# EAGLE design dual-dac-w-32-ch-sh (EAGLE 7.2.0)
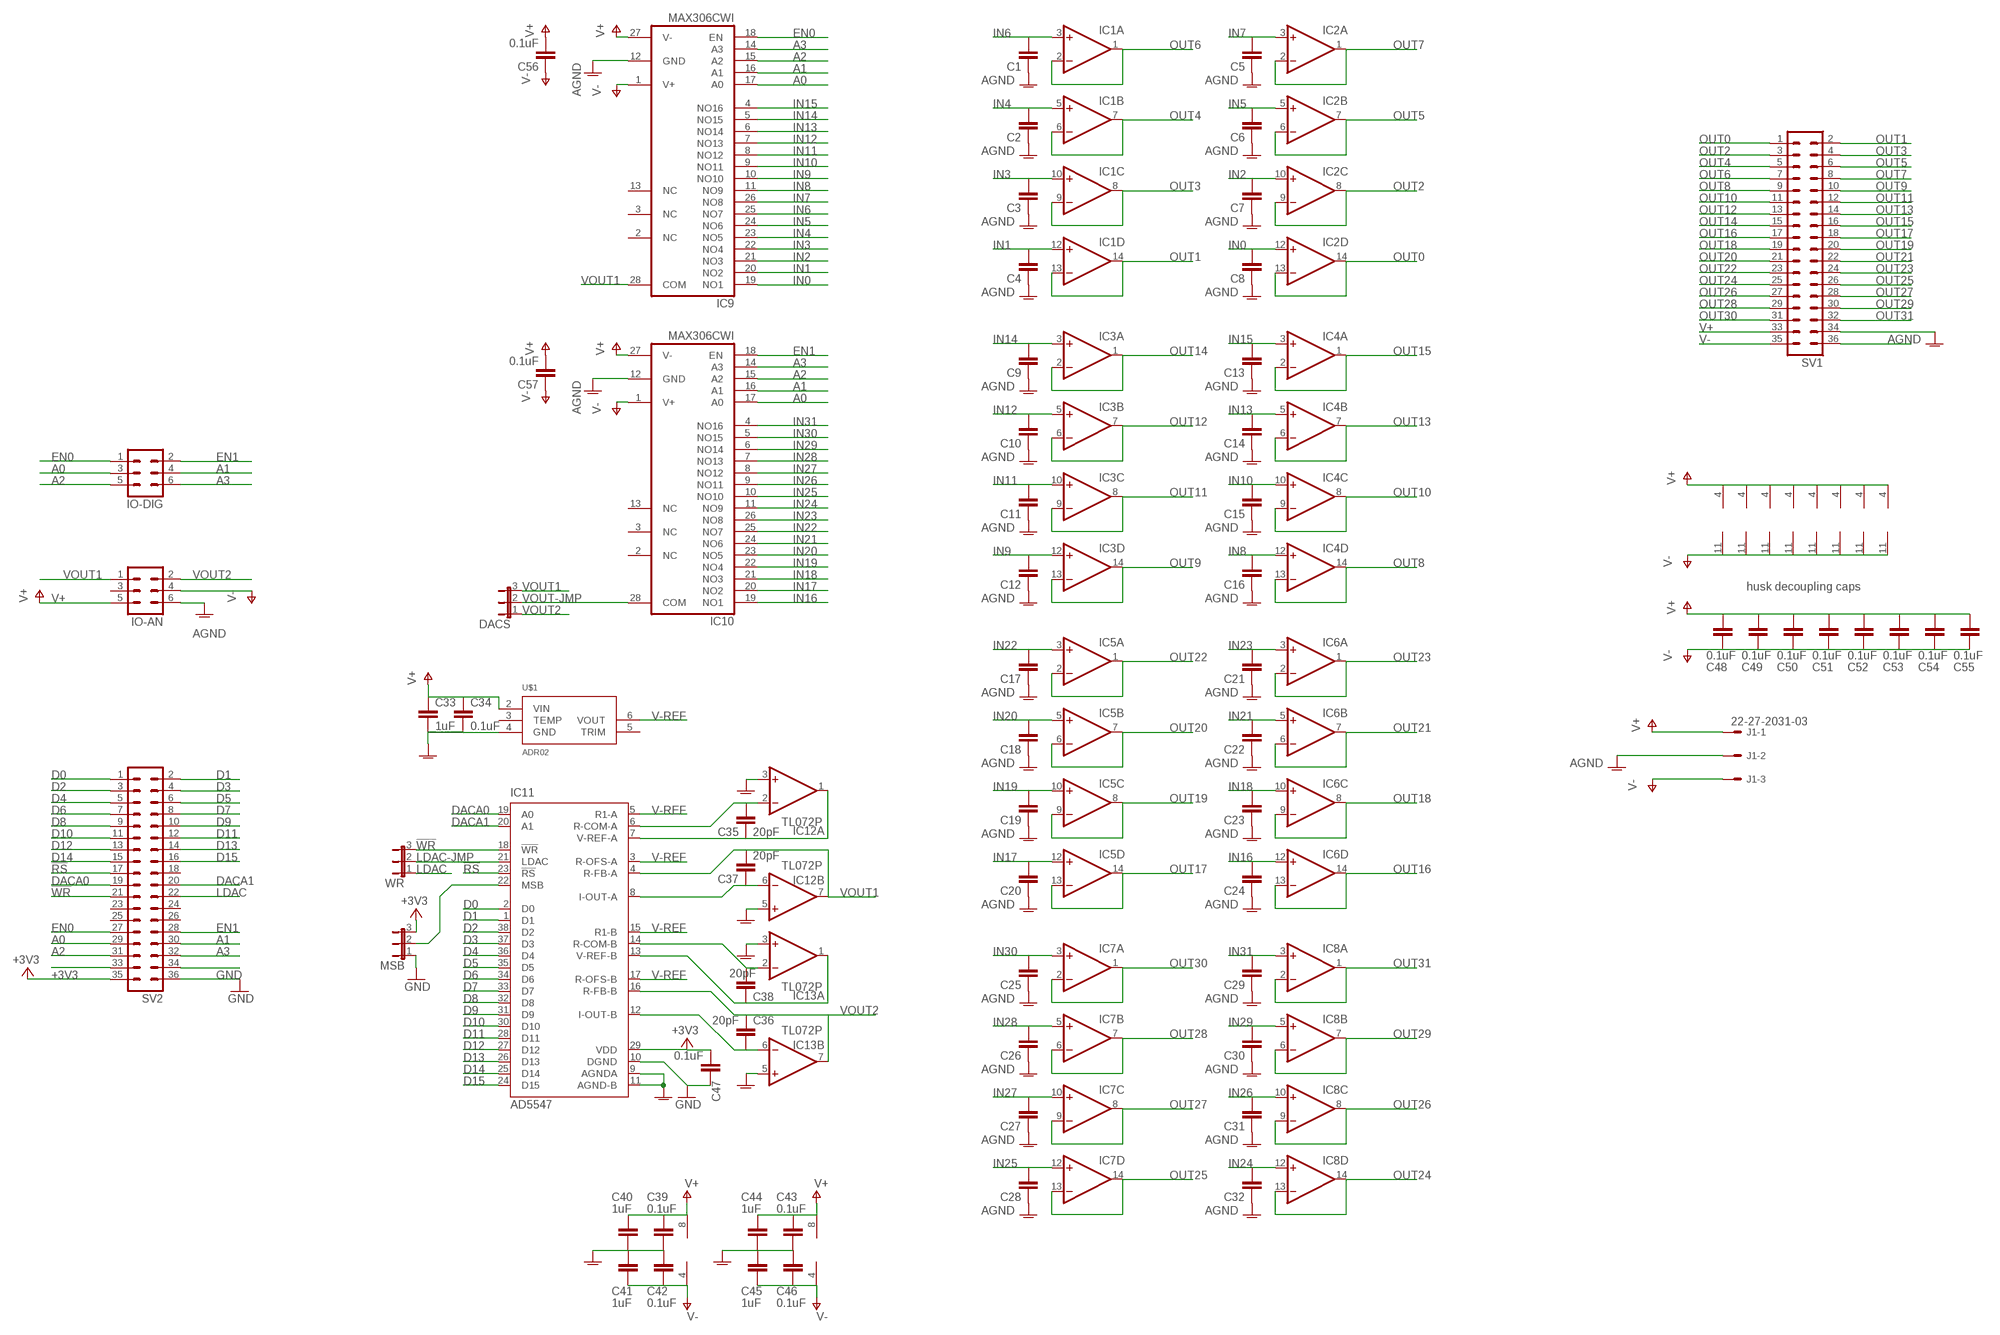
[diagram p0: schematic, sheet 1]

## Parts
C1  C-EUC1206  [C1206]
C2  C-EUC1206  [C1206]
C3  C-EUC1206  [C1206]
C4  C-EUC1206  [C1206]
C5  C-EUC1206  [C1206]
C6  C-EUC1206  [C1206]
C7  C-EUC1206  [C1206]
C8  C-EUC1206  [C1206]
C9  C-EUC1206  [C1206]
C10  C-EUC1206  [C1206]
C11  C-EUC1206  [C1206]
C12  C-EUC1206  [C1206]
C13  C-EUC1206  [C1206]
C14  C-EUC1206  [C1206]
C15  C-EUC1206  [C1206]
C16  C-EUC1206  [C1206]
C17  C-EUC1206  [C1206]
C18  C-EUC1206  [C1206]
C19  C-EUC1206  [C1206]
C20  C-EUC1206  [C1206]
C21  C-EUC1206  [C1206]
C22  C-EUC1206  [C1206]
C23  C-EUC1206  [C1206]
C24  C-EUC1206  [C1206]
C25  C-EUC1206  [C1206]
C26  C-EUC1206  [C1206]
C27  C-EUC1206  [C1206]
C28  C-EUC1206  [C1206]
C29  C-EUC1206  [C1206]
C30  C-EUC1206  [C1206]
C31  C-EUC1206  [C1206]
C32  C-EUC1206  [C1206]
C33  1uF  C-EUC0603  [C0603]
C34  0.1uF  C-EUC0603  [C0603]
C35  20pF  C-EUC0603  [C0603]
C36  20pF  C-EUC0603  [C0603]
C37  20pF  C-EUC0603  [C0603]
C38  20pF  C-EUC0603  [C0603]
C39  0.1uF  C-EUC0603  [C0603]
C40  1uF  C-EUC0603  [C0603]
C41  1uF  C-EUC0603  [C0603]
C42  0.1uF  C-EUC0603  [C0603]
C43  0.1uF  C-EUC0603  [C0603]
C44  1uF  C-EUC0603  [C0603]
C45  1uF  C-EUC0603  [C0603]
C46  0.1uF  C-EUC0603  [C0603]
C47  0.1uF  C-EUC0603  [C0603]
C48  0.1uF  C-EUC0603  [C0603]
C49  0.1uF  C-EUC0603  [C0603]
C50  0.1uF  C-EUC0603  [C0603]
C51  0.1uF  C-EUC0603  [C0603]
C52  0.1uF  C-EUC0603  [C0603]
C53  0.1uF  C-EUC0603  [C0603]
C54  0.1uF  C-EUC0603  [C0603]
C55  0.1uF  C-EUC0603  [C0603]
C56  0.1uF  C-EUC0603  [C0603]
C57  0.1uF  C-EUC0603  [C0603]
DACS  JP2E  [JP2]
IC1  TL074D  [SO14]
IC2  TL074D  [SO14]
IC3  TL074D  [SO14]
IC4  TL074D  [SO14]
IC5  TL074D  [SO14]
IC6  TL074D  [SO14]
IC7  TL074D  [SO14]
IC8  TL074D  [SO14]
IC9  MAX306CWI  [SO28L]
IC10  MAX306CWI  [SO28L]
IC11  AD5547  [TSSOP38]
IC12  TL072P  [DIL08]
IC13  TL072P  [DIL08]
IO-AN  MA03-2  [MA03-2]
IO-DIG  MA03-2  [MA03-2]
J1  22-27-2031-03  [6410-03]
MSB  JP2E  [JP2]
SV1  MA18-2  [MA18-2]
SV2  MA18-2  [MA18-2]
U$1  ADR02  [SO08]
WR  JP2E  [JP2]

## Nets
!RS: IC11.23(!RS) SV2.17
!WR: IC11.18(!WR) SV2.21 WR.3
+3V3: C47.1 IC11.29(VDD) MSB.3 SV2.35
A0: IC9.17(A0) IC10.17(A0) IO-DIG.3 SV2.29
A1: IC9.16(A1) IC10.16(A1) IO-DIG.4 SV2.30
A2: IC9.15(A2) IC10.15(A2) IO-DIG.5 SV2.31
A3: IC9.14(A3) IC10.14(A3) IO-DIG.6 SV2.32
AGND: C1.1 C2.1 C3.1 C4.1 C5.1 C6.1 C7.1 C8.1 C9.1 C10.1 C11.1 C12.1 C13.1 C14.1 C15.1 C16.1 C17.1 C18.1 C19.1 C20.1 C21.1 C22.1 C23.1 C24.1 C25.1 C26.1 C27.1 C28.1 C29.1 C30.1 C31.1 C32.1 C33.2 C34.2 C39.1 C40.1 C41.2 C42.2 C43.1 C44.1 C45.2 C46.2 IC9.12(GND) IC10.12(GND) IC11.9(AGNDA) IC11.11(AGND-B) IC12.3(A:+IN) IC12.5(B:+IN) IC13.3(A:+IN) IC13.5(B:+IN) IO-AN.6 J1.2 SV1.34 U$1.4(GND)
D0: IC11.2(D0) SV2.1
D1: IC11.1(D1) SV2.2
D2: IC11.38(D2) SV2.3
D3: IC11.37(D3) SV2.4
D4: IC11.36(D4) SV2.5
D5: IC11.35(D5) SV2.6
D6: IC11.34(D6) SV2.7
D7: IC11.33(D7) SV2.8
D8: IC11.32(D8) SV2.9
D9: IC11.31(D9) SV2.10
D10: IC11.30(D10) SV2.11
D11: IC11.28(D11) SV2.12
D12: IC11.27(D12) SV2.13
D13: IC11.26(D13) SV2.14
D14: IC11.25(D14) SV2.15
D15: IC11.24(D15) SV2.16
DACA0: IC11.19(A0) SV2.19
DACA1: IC11.20(A1) SV2.20
EN0: IC9.18(EN) IO-DIG.1 SV2.27
EN1: IC10.18(EN) IO-DIG.2 SV2.28
GND: C47.2 IC11.10(DGND) MSB.1 SV2.36
IN0: C8.2 IC2.12(D:+IN) IC9.19(NO1)
IN1: C4.2 IC1.12(D:+IN) IC9.20(NO2)
IN2: C7.2 IC2.10(C:+IN) IC9.21(NO3)
IN3: C3.2 IC1.10(C:+IN) IC9.22(NO4)
IN4: C2.2 IC1.5(B:+IN) IC9.23(NO5)
IN5: C6.2 IC2.5(B:+IN) IC9.24(NO6)
IN6: C1.2 IC1.3(A:+IN) IC9.25(NO7)
IN7: C5.2 IC2.3(A:+IN) IC9.26(NO8)
IN8: C16.2 IC4.12(D:+IN) IC9.11(NO9)
IN9: C12.2 IC3.12(D:+IN) IC9.10(NO10)
IN10: C15.2 IC4.10(C:+IN) IC9.9(NO11)
IN11: C11.2 IC3.10(C:+IN) IC9.8(NO12)
IN12: C10.2 IC3.5(B:+IN) IC9.7(NO13)
IN13: C14.2 IC4.5(B:+IN) IC9.6(NO14)
IN14: C9.2 IC3.3(A:+IN) IC9.5(NO15)
IN15: C13.2 IC4.3(A:+IN) IC9.4(NO16)
IN16: C24.2 IC6.12(D:+IN) IC10.19(NO1)
IN17: C20.2 IC5.12(D:+IN) IC10.20(NO2)
IN18: C23.2 IC6.10(C:+IN) IC10.21(NO3)
IN19: C19.2 IC5.10(C:+IN) IC10.22(NO4)
IN20: C18.2 IC5.5(B:+IN) IC10.23(NO5)
IN21: C22.2 IC6.5(B:+IN) IC10.24(NO6)
IN22: C17.2 IC5.3(A:+IN) IC10.25(NO7)
IN23: C21.2 IC6.3(A:+IN) IC10.26(NO8)
IN24: C32.2 IC8.12(D:+IN) IC10.11(NO9)
IN25: C28.2 IC7.12(D:+IN) IC10.10(NO10)
IN26: C31.2 IC8.10(C:+IN) IC10.9(NO11)
IN27: C27.2 IC7.10(C:+IN) IC10.8(NO12)
IN28: C26.2 IC7.5(B:+IN) IC10.7(NO13)
IN29: C30.2 IC8.5(B:+IN) IC10.6(NO14)
IN30: C25.2 IC7.3(A:+IN) IC10.5(NO15)
IN31: C29.2 IC8.3(A:+IN) IC10.4(NO16)
LDAC: SV2.22 WR.1
LDAC-JMP: IC11.21(LDAC) WR.2
N$1: C35.2 IC11.6(R-COM-A) IC12.2(A:-IN)
N$2: C35.1 IC11.7(V-REF-A) IC12.1(A:OUT)
N$3: C38.2 IC11.14(R-COM-B) IC13.2(A:-IN)
N$4: SV1.36
N$5: C38.1 IC11.13(V-REF-B) IC13.1(A:OUT)
N$6: IC11.22(MSB) MSB.2
N$7: C36.2 IC11.12(I-OUT-B) IC13.6(B:-IN)
N$10: C37.2 IC11.8(I-OUT-A) IC12.6(B:-IN)
N$12: SV2.33
N$16: SV2.34
OUT0: IC2.13(D:-IN) IC2.14(D:OUT) SV1.1
OUT1: IC1.13(D:-IN) IC1.14(D:OUT) SV1.2
OUT2: IC2.8(C:OUT) IC2.9(C:-IN) SV1.3
OUT3: IC1.8(C:OUT) IC1.9(C:-IN) SV1.4
OUT4: IC1.6(B:-IN) IC1.7(B:OUT) SV1.5
OUT5: IC2.6(B:-IN) IC2.7(B:OUT) SV1.6
OUT6: IC1.1(A:OUT) IC1.2(A:-IN) SV1.7
OUT7: IC2.1(A:OUT) IC2.2(A:-IN) SV1.8
OUT8: IC4.13(D:-IN) IC4.14(D:OUT) SV1.9
OUT9: IC3.13(D:-IN) IC3.14(D:OUT) SV1.10
OUT10: IC4.8(C:OUT) IC4.9(C:-IN) SV1.11
OUT11: IC3.8(C:OUT) IC3.9(C:-IN) SV1.12
OUT12: IC3.6(B:-IN) IC3.7(B:OUT) SV1.13
OUT13: IC4.6(B:-IN) IC4.7(B:OUT) SV1.14
OUT14: IC3.1(A:OUT) IC3.2(A:-IN) SV1.15
OUT15: IC4.1(A:OUT) IC4.2(A:-IN) SV1.16
OUT16: IC6.13(D:-IN) IC6.14(D:OUT) SV1.17
OUT17: IC5.13(D:-IN) IC5.14(D:OUT) SV1.18
OUT18: IC6.8(C:OUT) IC6.9(C:-IN) SV1.19
OUT19: IC5.8(C:OUT) IC5.9(C:-IN) SV1.20
OUT20: IC5.6(B:-IN) IC5.7(B:OUT) SV1.21
OUT21: IC6.6(B:-IN) IC6.7(B:OUT) SV1.22
OUT22: IC5.1(A:OUT) IC5.2(A:-IN) SV1.23
OUT23: IC6.1(A:OUT) IC6.2(A:-IN) SV1.24
OUT24: IC8.13(D:-IN) IC8.14(D:OUT) SV1.25
OUT25: IC7.13(D:-IN) IC7.14(D:OUT) SV1.26
OUT26: IC8.8(C:OUT) IC8.9(C:-IN) SV1.27
OUT27: IC7.8(C:OUT) IC7.9(C:-IN) SV1.28
OUT28: IC7.6(B:-IN) IC7.7(B:OUT) SV1.29
OUT29: IC8.6(B:-IN) IC8.7(B:OUT) SV1.30
OUT30: IC7.1(A:OUT) IC7.2(A:-IN) SV1.31
OUT31: IC8.1(A:OUT) IC8.2(A:-IN) SV1.32
V+: C33.1 C34.1 C39.2 C40.2 C43.2 C44.2 C48.2 C49.2 C50.2 C51.2 C52.2 C53.2 C54.2 C55.2 C56.2 C57.2 IC1.4(P:V+) IC2.4(P:V+) IC3.4(P:V+) IC4.4(P:V+) IC5.4(P:V+) IC6.4(P:V+) IC7.4(P:V+) IC8.4(P:V+) IC9.27(V-) IC10.27(V-) IC12.8(P:V+) IC13.8(P:V+) IO-AN.5 J1.1 SV1.33 U$1.2(VIN)
V-: C41.1 C42.1 C45.1 C46.1 C48.1 C49.1 C50.1 C51.1 C52.1 C53.1 C54.1 C55.1 C56.1 C57.1 IC1.11(P:V-) IC2.11(P:V-) IC3.11(P:V-) IC4.11(P:V-) IC5.11(P:V-) IC6.11(P:V-) IC7.11(P:V-) IC8.11(P:V-) IC9.1(V+) IC10.1(V+) IC12.4(P:V-) IC13.4(P:V-) IO-AN.4 J1.3 SV1.35
V-REF: IC11.3(R-OFS-A) IC11.5(R1-A) IC11.15(R1-B) IC11.17(R-OFS-B) U$1.6(VOUT)
VOUT1: C37.1 DACS.3 IC9.28(COM) IC11.4(R-FB-A) IC12.7(B:OUT) IO-AN.1
VOUT2: C36.1 DACS.1 IC11.16(R-FB-B) IC13.7(B:OUT) IO-AN.2
VOUT-JMP: DACS.2 IC10.28(COM)
Unconnected: IC9.2(NC) IC9.3(NC) IC9.13(NC) IC10.2(NC) IC10.3(NC) IC10.13(NC) IO-AN.3 SV2.18 SV2.23 SV2.24 SV2.25 SV2.26 U$1.3(TEMP) U$1.5(TRIM)

## Notes on the sheet
- husk decoupling caps

## Library data of the parts
C1-C57 = resistor:C-EU: CAPACITOR, European symbol
DACS MSB WR = jumper:JP2E: JUMPER
IC1-IC8 = linear:TL074: OP AMP
IC9 IC10 = maxim:MAX306CWI: MULTIPLEXER; MF: MAXIM; MPN: MAX306CWI; OC_FARNELL: unknown; OC_NEWARK: 90C2555
IC11 = joakim:AD5547: Dual-Current Output, Parallel Input 16 bit Multiplying DAC Source: http://www.analog.com/media/en/technical-documentation/data-sheets/AD5547_5557.pdf
IC12 IC13 = linear:TL072: OP AMP
IO-AN IO-DIG = con-lstb:MA03-2: PIN HEADER; OC_FARNELL: unknown; OC_NEWARK: unknown
J1 = con-molex:22-?-03: CONNECTOR wire to board 2.54 mm (.1 inch) pitch header; OC_FARNELL: unknown; OC_NEWARK: unknown
SV1 SV2 = con-lstb:MA18-2: PIN HEADER; OC_FARNELL: unknown; OC_NEWARK: unknown
U$1 = joakim:ADR02: Ultracompact Precision 5.0V Voltage Reference Analog Devices http://docs-europe.electrocomponents.com/webdocs/10ad/0900766b810adbed.pdf

## Board
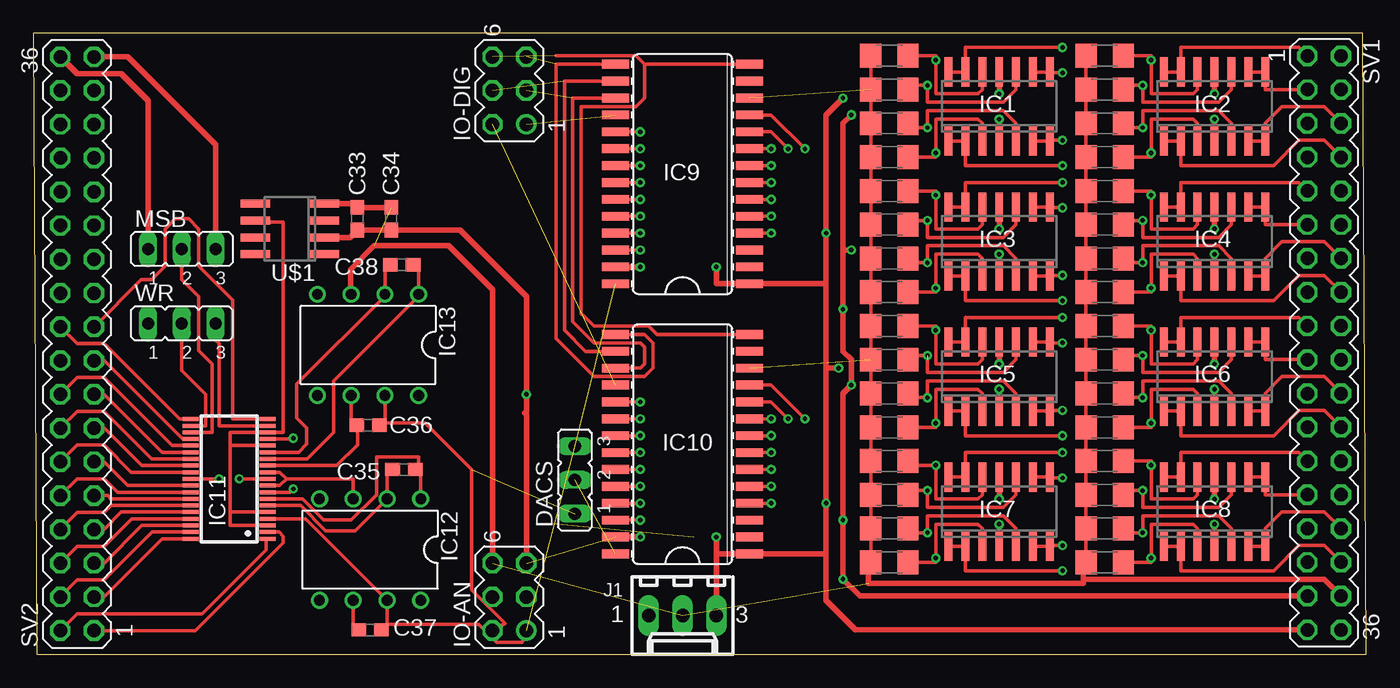
[diagram p1: board, top side]
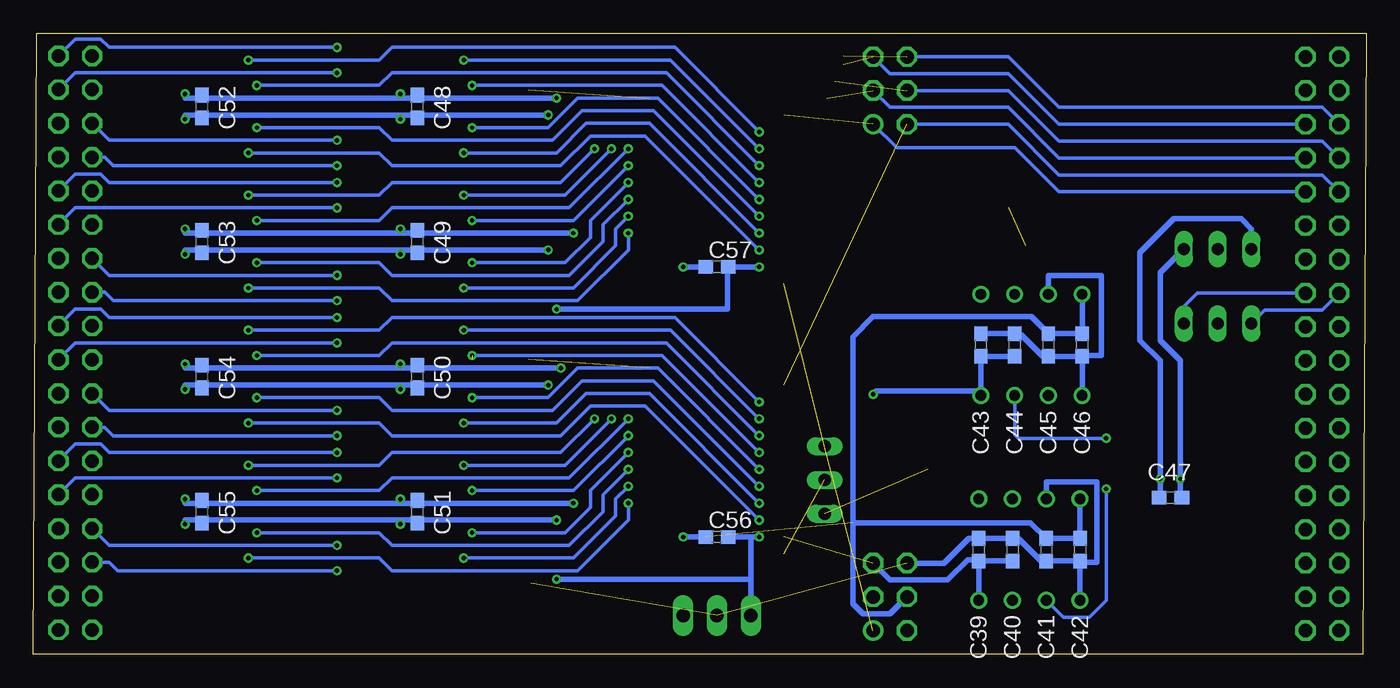
[diagram p2: board, bottom side, seen from below]

Size 100.25 x 46.73 mm. Coordinates in mm from the lower left corner, seen from the top.
Outline: 0.25,0 100.25,0 100,46.73 0,46.73 0.25,0
Copper layers (1*16): Top 0.0356mm / dielectric 1.5011mm / Bottom 0.0356mm
Design rules "LaenPCBOrder": minimum track width 6mil, minimum drill 13mil, track to track 6mil, track to pad 6mil, pad to pad 6mil, via to via 6mil, smd to smd 6mil, copper to edge 15mil, drill to drill 6mil, minimum pad ring 7mil, minimum via ring 7mil, stop-mask expansion 3mil, vias tented up to drill 0mil, thermal gap 10mil

### Footprints (pad centres in the part's own frame; a part is rotated, then mirrored left to right if it is on the bottom)
C1206 = smd 1.6 x 1.8: 1 -1.4,0; 2 1.4,0
C0603 = smd 1.1 x 1: 1 -0.85,0; 2 0.85,0
JP2 = drill 0.914 long: 1 -2.54,0; 2 0,0; 3 2.54,0
SO14 = smd 0.6 x 2.2: 1 -3.81,-2.6; 2 -2.54,-2.6; 3 -1.27,-2.6; 4 0,-2.6; 5 1.27,-2.6; 6 2.54,-2.6; 7 3.81,-2.6; 8 3.81,2.6; 9 2.54,2.6; 10 1.27,2.6; 11 0,2.6; 12 -1.27,2.6; 13 -2.54,2.6; 14 -3.81,2.6
SO28L = smd 0.66 x 2.032: 1 -8.255,-5.029; 2 -6.985,-5.029; 3 -5.715,-5.029; 4 -4.445,-5.029; 5 -3.175,-5.029; 6 -1.905,-5.029; 7 -0.635,-5.029; 8 0.635,-5.029; 9 1.905,-5.029; 10 3.175,-5.029; 11 4.445,-5.029; 12 5.715,-5.029; 13 6.985,-5.029; 14 8.255,-5.029; 15 8.255,5.029; 16 6.985,5.029; 17 5.715,5.029; 18 4.445,5.029; 19 3.175,5.029; 20 1.905,5.029; 21 0.635,5.029; 22 -0.635,5.029; 23 -1.905,5.029; 24 -3.175,5.029; 25 -4.445,5.029; 26 -5.715,5.029; 27 -6.985,5.029; 28 -8.255,5.029
TSSOP38 = smd 0.3 x 1.2: 1 -4.5,-2.9; 2 -4,-2.9; 3 -3.5,-2.9; 4 -3,-2.9; 5 -2.5,-2.9; 6 -2,-2.9; 7 -1.5,-2.9; 8 -1,-2.9; 9 -0.5,-2.9; 10 0,-2.9; 11 0.5,-2.9; 12 1,-2.9; 13 1.5,-2.9; 14 2,-2.9; 15 2.5,-2.9; 16 3,-2.9; 17 3.5,-2.9; 18 4,-2.9; 19 4.5,-2.9; 20 4.5,2.9; 21 4,2.9; 22 3.5,2.9; 23 3,2.9; 24 2.5,2.9; 25 2,2.9; 26 1.5,2.9; 27 1,2.9; 28 0.5,2.9; 29 0,2.9; 30 -0.5,2.9; 31 -1,2.9; 32 -1.5,2.9; 33 -2,2.9; 34 -2.5,2.9; 35 -3,2.9; 36 -3.5,2.9; 37 -4,2.9; 38 -4.5,2.9
DIL08 = drill 0.813 pad 1.27: 1 -3.81,-3.81; 2 -1.27,-3.81; 3 1.27,-3.81; 4 3.81,-3.81; 5 3.81,3.81; 6 1.27,3.81; 7 -1.27,3.81; 8 -3.81,3.81
MA03-2 = drill 1.016: 1 -2.54,-1.27 | drill 1.016 octagon: 2 -2.54,1.27; 3 0,-1.27; 4 0,1.27; 5 2.54,-1.27; 6 2.54,1.27
6410-03 = drill 1.016 long: 1 2.54,0; 2 0,0; 3 -2.54,0
MA18-2 = drill 1.016 octagon: 1 -21.59,-1.27; 2 -21.59,1.27; 3 -19.05,-1.27; 4 -19.05,1.27; 5 -16.51,-1.27; 6 -16.51,1.27; 7 -13.97,-1.27; 8 -13.97,1.27; 9 -11.43,-1.27; 10 -11.43,1.27; 11 -8.89,-1.27; 12 -8.89,1.27; 13 -6.35,-1.27; 14 -6.35,1.27; 15 -3.81,-1.27; 16 -3.81,1.27; 17 -1.27,-1.27; 18 -1.27,1.27; 19 1.27,-1.27; 20 1.27,1.27; 21 3.81,-1.27; 22 3.81,1.27; 23 6.35,-1.27; 24 6.35,1.27; 25 8.89,-1.27; 26 8.89,1.27; 27 11.43,-1.27; 28 11.43,1.27; 29 13.97,-1.27; 30 13.97,1.27; 31 16.51,-1.27; 32 16.51,1.27; 33 19.05,-1.27; 34 19.05,1.27; 35 21.59,-1.27; 36 21.59,1.27
SO08 = smd 0.6 x 2.2: 1 -1.905,-2.6; 2 -0.635,-2.6; 3 0.635,-2.6; 4 1.905,-2.6; 5 1.905,2.6; 6 0.635,2.6; 7 -0.635,2.6; 8 -1.905,2.6

### Placement (x,y rotation side)
C1  64.39,37.4 0 top
C2  64.39,39.94 0 top
C3  64.39,42.48 0 top
C4  64.39,45.02 0 top
C5  80.58,37.4 0 top
C6  80.58,39.94 0 top
C7  80.58,42.48 0 top
C8  80.58,45.02 0 top
C9  64.39,27.24 0 top
C10  64.39,29.78 0 top
C11  64.39,32.32 0 top
C12  64.39,34.86 0 top
C13  80.58,27.24 0 top
C14  80.58,29.78 0 top
C15  80.58,32.32 0 top
C16  80.58,34.86 0 top
C17  64.39,17.08 0 top
C18  64.39,19.62 0 top
C19  64.39,22.16 0 top
C20  64.39,24.7 0 top
C21  80.58,17.08 0 top
C22  80.58,19.62 0 top
C23  80.58,22.16 0 top
C24  80.58,24.7 0 top
C25  64.39,6.92 0 top
C26  64.39,9.46 0 top
C27  64.39,12 0 top
C28  64.39,14.54 0 top
C29  80.58,6.92 0 top
C30  80.58,9.46 0 top
C31  80.58,12 0 top
C32  80.58,14.54 0 top
C33  24.38,32.77 90 top
C34  26.92,32.77 90 top
C35  27.88,13.91 180 top
C36  25.18,17.24 180 top
C37  25.34,1.84 180 top
C38  27.72,29.31 180 top
C39  29.15,7.87 270 bottom
C40  26.61,7.87 270 bottom
C41  24.07,7.87 270 bottom
C42  21.53,7.87 270 bottom
C43  28.99,23.27 270 bottom
C44  26.45,23.27 270 bottom
C45  23.91,23.27 270 bottom
C46  21.37,23.27 270 bottom
C47  14.72,11.79 180 bottom
C48  71.37,41.21 270 bottom
C49  71.37,31.05 270 bottom
C50  71.37,20.89 270 bottom
C51  71.37,10.73 270 bottom
C52  87.57,41.21 270 bottom
C53  87.57,31.05 270 bottom
C54  87.57,20.89 270 bottom
C55  87.57,10.73 270 bottom
C56  48.83,8.83 0 bottom
C57  48.83,29.15 0 bottom
DACS  40.74,13.11 90 top
IC1  72.64,41.21 0 top
IC2  88.84,41.21 0 top
IC3  72.64,31.05 0 top
IC4  88.84,31.05 0 top
IC5  72.64,20.89 0 top
IC6  88.84,20.89 0 top
IC7  72.64,10.73 0 top
IC8  88.84,10.73 0 top
IC9  48.83,36.13 90 top
IC10  48.83,15.81 90 top
IC11  14.74,13.2 90 top
IC12  25.34,7.87 180 top
IC13  25.18,23.27 180 top
IO-AN  35.81,4.32 90 top
IO-DIG  35.81,42.42 90 top
J1  48.83,2.92 180 top
MSB  11.18,30.48 0 top
SV1  97.09,23.43 270 top
SV2  3.3,23.37 90 top
U$1  19.3,32 90 top
WR  11.18,24.89 0 top

### Tracks (layer width: path | path; a pad name or v marks a point on that pad's centre or on a via)
!RS
  Top 0.254: SV2.17 5.33,22.1 11.23,16.2 IC11.23
!WR
  Top 0.254: IC11.18 13.97,17.2 13.97,23.37 13.72,23.62 WR.3
  Bottom 0.254: SV2.21 12.7,27.18 13.72,26.16 WR.3
+3V3  (via drill 0.33)
  Top 0.254: IC11.29 v13.97,13.2
  Top 0.406: SV2.35 7.11,44.96 13.72,38.35 MSB.3
  Bottom 0.406: MSB.3 15.49,28.7 15.49,23.62 13.97,22.1 v13.97,13.2 13.97,11.68 13.87,11.78 C47.1
A0  (1 unrouted)
  Top 0.254: IC9.17 40.58,41.85 40.58,25.02 42.16,23.43 45.66,23.43 45.97,23.11 45.97,21.84 45.66,21.53 IC10.17
  Bottom 0.254: SV2.29 23.11,37.34 26.92,41.15 35.81,41.15 IO-DIG.3
A1  (1 unrouted)
  Top 0.254: IC9.16 39.94,43.12 39.94,24.38 41.53,22.8 IC10.16
  Bottom 0.254: SV2.30 3.3,38.61 23.11,38.61 26.92,42.42 IO-DIG.4
A2  (1 unrouted)
  Top 0.254: 40.89,44.39 IC9.15 39.31,44.39 39.31,23.75 42.16,20.89 45.97,20.89 46.61,21.53 46.61,23.43 45.97,24.07 IC10.15
  Bottom 0.254: SV2.31 23.11,39.88 26.92,43.69 35.81,43.69 IO-DIG.5
A3  (1 unrouted)
  Top 0.254: IC9.14 45.97,44.39 | 39.31,45.02 45.34,45.02 45.97,44.39 | IC10.14 46.93,24.07 46.29,24.7 42.16,24.7 41.43,25.43 41.21,25.65 41.21,41.21 45.34,41.21 45.97,41.85 45.97,44.39
  Bottom 0.254: SV2.32 3.3,41.15 23.11,41.15 26.92,44.96 IO-DIG.6
AGND  (via drill 0.33)  (5 unrouted)
  Top 0.254: C8.1 C7.1 C6.1 C5.1 C15.1 C16.1 C13.1 C14.1 C22.1 C23.1 C24.1 C21.1 C30.1 C31.1 C29.1 C32.1 | C4.1 C3.1 C2.1 C1.1 C12.1 C11.1 C10.1 C9.1 C19.1 C20.1 C17.1 C18.1 C27.1 C28.1 C25.1 C26.1 | 17.64,12.72 IC11.9 18.54,12.7 19.05,13.21 | 19.05,13.21 18.54,13.7 IC11.11 | 19.05,13.21 24.07,13.21 IC12.3
  Top 0.406: SV1.34 97.09,5.65 78.99,5.65 | 78.99,5.65 78.99,5.33 62.8,5.33 62.8,6.73 C25.1 | 78.99,5.65 78.99,6.73 C29.1 | U$1.4 24.09,33.91 C33.2 C34.2 | v23.88,27.18 23.88,28.96 25.65,30.73 31.24,30.73 34.54,27.43 IO-AN.6
  Bottom 0.406: IC12.5 C42.2 | C42.2 C41.2 24.49,7.02 26.13,8.67 26.55,8.67 C40.1 C39.1 29.88,8.72 31.75,6.86 IO-AN.6 | IC13.5 C46.2 | C46.2 C45.2 24.33,22.42 25.97,24.07 26.39,24.07 C44.1 C43.1 | IC12.3 24.07,12.95 20.26,12.95 20.26,6.92 21.42,6.92 C42.2 | IC13.3 23.91,27.21 | C46.2 21.31,22.48 19.94,22.48 19.94,28.51 23.91,28.51 23.91,27.21 | 23.91,27.21 v23.88,27.18
D0
  Top 0.254: SV2.1 12.19,1.78 18.8,8.38 18.8,8.89 18.49,9.2 IC11.2
D1
  Top 0.254: SV2.2 3.3,3.05 12.7,3.05 17.53,7.87 17.53,8.58 IC11.1
D2
  Top 0.254: IC11.38 9.71,8.7 5.33,4.32 SV2.3
D3
  Top 0.254: IC11.37 8.94,9.2 5.33,5.59 3.3,5.59 SV2.4
D4
  Top 0.254: IC11.36 8.17,9.7 5.33,6.86 SV2.5
D5
  Top 0.254: IC11.35 7.4,10.2 5.33,8.13 3.3,8.13 SV2.6
D6
  Top 0.254: IC11.34 6.63,10.7 5.33,9.4 SV2.7
D7
  Top 0.254: IC11.33 5.86,11.2 5.33,10.67 3.3,10.67 SV2.8
D8
  Top 0.254: IC11.32 5.83,11.7 5.59,11.94 SV2.9
D9
  Top 0.254: IC11.31 6.35,12.2 5.33,13.21 3.3,13.21 SV2.10
D10
  Top 0.254: IC11.30 7.12,12.7 5.33,14.48 SV2.11
D11
  Top 0.254: IC11.28 7.38,13.7 5.33,15.75 3.3,15.75 SV2.12
D12
  Top 0.254: IC11.27 8.15,14.2 5.33,17.02 SV2.13
D13
  Top 0.254: IC11.26 8.92,14.7 5.33,18.29 3.3,18.29 SV2.14
D14
  Top 0.254: IC11.25 9.7,15.2 5.33,19.56 SV2.15
D15
  Top 0.254: IC11.24 10.46,15.7 5.33,20.83 3.3,20.83 SV2.16
DACA0
  Top 0.254: SV2.19 8.13,28.19 8.89,28.19 9.91,29.21 9.91,32 10.67,32.77 11.68,32.77 12.45,32 12.45,29.21 14.99,26.67 14.99,17.7 IC11.19
DACA1
  Top 0.254: SV2.20 3.3,23.37 5.33,23.37 11,17.7 IC11.20
EN0  (1 unrouted)
  Bottom 0.254: SV2.27 23.11,34.8 26.42,38.1 35.31,38.1 IO-DIG.1
EN1  (1 unrouted)
  Bottom 0.254: SV2.28 3.3,36.07 23.11,36.07 26.92,39.88 IO-DIG.2
GND  (via drill 0.33)
  Top 0.254: IC11.10 15.53,13.2 | 15.49,13.16 15.53,13.2 | 15.53,13.2 v15.5,13.2 v15.49,13.21
  Top 0.406: SV2.36 3.3,43.69 6.6,43.69 8.64,41.66 MSB.1
  Bottom 0.406: MSB.1 8.64,32 9.4,32.77 14.48,32.77 17.02,30.23 17.02,23.62 15.49,22.1 v15.49,13.21 15.49,11.68 15.57,11.76 C47.2
IN0  (via drill 0.33)
  Top 0.254: IC2.12 87.57,42.48 87.25,42.16 84.07,42.16 v84.07,44.7 84.07,45.02 C8.2 | IC9.19 v45.66,39.31
  Bottom 0.254: v84.07,44.7 74.23,44.7 73.28,45.66 52.01,45.66 v45.66,39.31
IN1  (via drill 0.33)
  Top 0.254: IC1.12 71.37,42.48 71.06,42.16 67.88,42.16 v67.88,44.7 67.88,45.02 C4.2 | v45.66,38.04 IC9.20
  Bottom 0.254: v67.88,44.7 52.32,44.7 v45.66,38.04
IN2  (via drill 0.33)
  Top 0.254: C7.2 82.62,42.35 82.49,42.48 82.8,42.8 v83.44,42.8 83.44,41.53 89.15,41.53 90.11,42.48 IC2.10 | v45.66,36.77 IC9.21
  Bottom 0.254: v83.44,42.8 74.23,42.8 73.28,43.75 52.64,43.75 v45.66,36.77
IN3  (via drill 0.33)
  Top 0.254: IC1.10 73.91,42.48 72.96,41.53 67.25,41.53 v67.25,42.8 66.11,42.8 C3.2 | v45.66,35.5 IC9.22
  Bottom 0.254: v67.25,42.8 52.96,42.8 v45.66,35.5
IN4  (via drill 0.33)
  Top 0.254: 66.42,40.07 C2.2 66.11,39.62 v67.25,39.62 67.25,40.89 72.96,40.89 73.91,39.94 IC1.5 | v45.66,34.23 IC9.23
  Bottom 0.254: v67.25,39.62 61.53,39.62 59.31,41.85 53.28,41.85 v45.66,34.23
IN5  (via drill 0.33)
  Top 0.254: 82.62,40.07 C6.2 82.3,39.62 v83.44,39.62 83.44,40.89 89.15,40.89 90.11,39.94 IC2.5 | v45.66,32.96 IC9.24
  Bottom 0.254: v83.44,39.62 74.23,39.62 73.28,38.67 61.21,38.67 58.99,40.89 53.59,40.89 v45.66,32.96
IN6  (via drill 0.33)
  Top 0.254: IC1.3 71.37,39.94 71.06,40.26 67.88,40.26 v67.88,37.72 67.88,37.4 C1.2 | v45.66,31.69 IC9.25
  Bottom 0.254: v67.88,37.72 60.9,37.72 58.67,39.94 53.91,39.94 v45.66,31.69
IN7  (via drill 0.33)
  Top 0.254: IC2.3 87.57,39.94 87.25,40.26 84.07,40.26 v84.07,37.72 84.07,37.4 C5.2 | v45.66,30.42 IC9.26
  Bottom 0.254: v84.07,37.72 74.23,37.72 73.28,36.77 60.58,36.77 58.36,38.99 54.23,38.99 v45.66,30.42
IN8  (via drill 0.33)
  Top 0.254: IC4.12 87.57,32.32 87.25,32 84.07,32 v84.07,34.54 84.07,34.86 C16.2 | v58.04,38.04 55.5,40.58 IC9.11
  Bottom 0.254: v84.07,34.54 74.23,34.54 73.28,35.5 60.58,35.5 v58.04,38.04
IN9  (via drill 0.33)
  Top 0.254: IC3.12 71.37,32.32 71.06,32 67.88,32 v67.88,34.54 67.88,34.86 C12.2 | v56.77,38.04 55.5,39.31 IC9.10
  Bottom 0.254: v67.88,34.54 60.26,34.54 v56.77,38.04
IN10  (via drill 0.33)
  Top 0.254: IC4.10 90.11,32.32 89.15,31.37 83.44,31.37 v83.44,32.64 82.8,32.64 82.49,32.32 C15.2 | v55.5,38.04 IC9.9
  Bottom 0.254: v83.44,32.64 74.23,32.64 73.28,33.59 59.94,33.59 v55.5,38.04
IN11  (via drill 0.33)
  Top 0.254: IC3.10 73.91,32.32 72.96,31.37 67.25,31.37 v67.25,32.64 66.61,32.64 C11.2 | v55.5,36.77 IC9.8
  Bottom 0.254: v67.25,32.64 59.63,32.64 v55.5,36.77
IN12  (via drill 0.33)
  Top 0.254: IC3.5 73.91,29.78 72.96,30.73 67.25,30.73 v67.25,29.46 66.61,29.46 66.29,29.78 C10.2 | v55.5,35.5 IC9.7
  Bottom 0.254: v67.25,29.46 60.26,29.46 58.36,31.37 58.36,32.64 v55.5,35.5
IN13  (via drill 0.33)
  Top 0.254: IC4.5 90.11,29.78 89.15,30.73 83.44,30.73 v83.44,29.46 82.8,29.46 82.49,29.78 C14.2 | v55.5,34.23 IC9.6
  Bottom 0.254: v83.44,29.46 74.23,29.46 73.28,28.51 59.94,28.51 57.4,31.05 57.4,32.32 v55.5,34.23
IN14  (via drill 0.33)
  Top 0.254: IC3.3 71.37,29.78 71.06,30.1 67.88,30.1 v67.88,27.56 67.88,27.24 C9.2 | v55.5,32.96 IC9.5
  Bottom 0.254: v67.88,27.56 59.63,27.56 56.45,30.73 56.45,32 v55.5,32.96
IN15  (via drill 0.33)
  Top 0.254: IC4.3 87.57,29.78 87.25,30.1 84.07,30.1 v84.07,27.56 84.07,27.24 C13.2 | IC9.4 v55.5,31.69
  Bottom 0.254: v84.07,27.56 74.23,27.56 73.28,26.61 59.31,26.61 55.5,30.42 v55.5,31.69
IN16  (via drill 0.33)
  Top 0.254: IC6.12 87.57,22.16 87.25,21.84 84.07,21.84 v84.07,24.38 84.07,24.7 C24.2 | IC10.19 v45.66,18.99
  Bottom 0.254: v45.66,18.99 52.01,25.34 73.28,25.34 74.23,24.38 v84.07,24.38
IN17  (via drill 0.33)
  Top 0.254: IC5.12 71.37,22.16 71.06,21.84 67.88,21.84 v67.88,24.38 67.88,24.7 C20.2 | IC10.20 v45.66,17.72
  Bottom 0.254: v45.66,17.72 52.32,24.38 v67.88,24.38
IN18  (via drill 0.33)
  Top 0.254: IC6.10 90.11,22.16 89.15,21.21 83.44,21.21 v83.44,22.48 82.49,22.48 82.17,22.16 C23.2 | IC10.21 v45.66,16.45
  Bottom 0.254: v45.66,16.45 52.64,23.43 73.28,23.43 74.23,22.48 v83.44,22.48
IN19  (via drill 0.33)  (1 unrouted)
  Top 0.254: IC5.10 73.91,22.16 72.96,21.21 67.25,21.21 67.25,22.16 | IC10.22 v45.66,15.18 | v67.25,22.48 66.29,22.48 65.98,22.16 C19.2
  Bottom 0.254: v45.66,15.18 52.96,22.48 v67.25,22.48
IN20  (via drill 0.33)
  Top 0.254: IC10.23 v45.66,13.91 | C18.2 66.11,19.3 v67.25,19.3 67.25,20.57 72.96,20.57 73.91,19.62 IC5.5
  Bottom 0.254: v45.66,13.91 53.28,21.53 59.31,21.53 61.53,19.3 v67.25,19.3
IN21  (via drill 0.33)
  Top 0.254: IC10.24 v45.66,12.64 | v83.44,19.3 82.3,19.3 C22.2 81.98,19.49 82.17,19.3 v83.44,19.3 | v83.44,19.3 83.44,20.57 89.15,20.57 90.11,19.62 IC6.5
  Bottom 0.254: v45.66,12.64 53.59,20.57 58.99,20.57 61.21,18.35 73.28,18.35 74.23,19.3 v83.44,19.3
IN22  (via drill 0.33)
  Top 0.254: IC5.3 71.37,19.62 71.06,19.94 67.88,19.94 v67.88,17.4 67.88,17.08 C17.2 | IC10.25 v45.66,11.37
  Bottom 0.254: v45.66,11.37 53.91,19.62 58.67,19.62 60.9,17.4 v67.88,17.4
IN23  (via drill 0.33)
  Top 0.254: IC6.3 87.57,19.62 87.25,19.94 84.07,19.94 v84.07,17.4 84.07,17.08 C21.2 | IC10.26 v45.66,10.1
  Bottom 0.254: v45.66,10.1 54.23,18.67 58.36,18.67 60.58,16.45 73.28,16.45 74.23,17.4 v84.07,17.4
IN24  (via drill 0.33)
  Top 0.254: IC8.12 87.57,12 87.25,11.68 84.07,11.68 v84.07,14.22 84.07,14.54 C32.2 | IC10.11 55.5,20.26 v58.04,17.72
  Bottom 0.254: v58.04,17.72 60.58,15.18 73.28,15.18 74.23,14.22 v84.07,14.22
IN25  (via drill 0.33)
  Top 0.254: IC7.12 71.37,12 71.06,11.68 67.88,11.68 v67.88,14.22 66.29,14.22 | IC10.10 55.5,18.99 v56.77,17.72 | 66.29,14.22 66.11,14.22 C28.2 65.98,14.54 66.29,14.22
  Bottom 0.254: v56.77,17.72 60.26,14.22 v67.88,14.22
IN26  (via drill 0.33)
  Top 0.254: IC8.10 90.11,12 89.15,11.05 83.44,11.05 v83.44,12.32 82.49,12.32 82.17,12 C31.2 | IC10.9 v55.5,17.72
  Bottom 0.254: v55.5,17.72 59.94,13.27 73.28,13.27 74.23,12.32 v83.44,12.32
IN27  (via drill 0.33)
  Top 0.254: IC7.10 73.91,12 72.96,11.05 67.25,11.05 v67.25,12.32 66.29,12.32 | IC10.8 v55.5,16.45 | 66.29,12.32 66.11,12.32 C27.2 65.98,12 66.29,12.32
  Bottom 0.254: v55.5,16.45 59.63,12.32 v67.25,12.32
IN28  (via drill 0.33)
  Top 0.254: IC7.5 73.91,9.46 72.96,10.41 67.25,10.41 v67.25,9.14 66.29,9.14 | IC10.7 v55.5,15.18 | 66.29,9.14 66.11,9.14 C26.2 65.98,9.46 66.29,9.14
  Bottom 0.254: v55.5,15.18 58.36,12.32 58.36,11.05 60.26,9.14 v67.25,9.14
IN29  (via drill 0.33)
  Top 0.254: IC8.5 90.11,9.46 89.15,10.41 83.44,10.41 v83.44,9.14 82.49,9.14 | IC10.6 v55.5,13.91 | 82.49,9.14 82.3,9.14 C30.2 82.17,9.46 82.49,9.14
  Bottom 0.254: v55.5,13.91 57.4,12 57.4,10.73 59.94,8.19 73.28,8.19 74.23,9.14 v83.44,9.14
IN30  (via drill 0.33)
  Top 0.254: IC7.3 71.37,9.46 71.06,9.78 67.88,9.78 v67.88,7.24 67.88,6.92 C25.2 | IC10.5 v55.5,12.64
  Bottom 0.254: v55.5,12.64 56.45,11.68 56.45,10.41 59.63,7.24 v67.88,7.24
IN31  (via drill 0.33)
  Top 0.254: IC8.3 87.57,9.46 87.25,9.78 84.07,9.78 v84.07,7.24 84.07,6.92 C29.2 | IC10.4 v55.5,11.37
  Bottom 0.254: v55.5,11.37 55.5,10.1 59.31,6.29 73.28,6.29 74.23,7.24 v84.07,7.24
LDAC
  Bottom 0.254: SV2.22 3.3,25.91 7.62,25.91 WR.1
LDAC-JMP
  Top 0.254: WR.2 11.18,21.34 12.95,19.56 12.95,17.2 IC11.21
N$1
  Top 0.254: C35.2 26.61,13.49 IC12.2 24.23,9.3 22,9.3 20.11,11.2 IC11.6
N$2
  Top 0.254: IC12.1 29.15,13.49 C35.1 28.99,14.17 28.99,14.86 25.81,14.86 25.81,12 23.91,10.1 21.84,10.1 20.24,11.7 IC11.7
N$3
  Top 0.254: C38.2 26.45,28.89 IC13.2 26.45,26.96 19.81,20.32 19.81,17.78 20.57,17.02 20.57,15.81 19.96,15.2 IC11.14
N$5
  Top 0.254: C38.1 28.99,28.89 IC13.1 28.99,26.96 22.61,20.57 22.61,16.7 20.61,14.7 IC11.13
N$6
  Top 0.254: IC11.22 13.46,16.7 13.46,21.84 12.45,22.86 12.45,26.92 11.18,28.19 MSB.2
N$7
  Top 0.254: IC13.6 23.91,17.66 C36.2 | 24.07,17.24 C36.2 | IC11.12 22.83,14.2 24.38,15.75 24.38,17.18 C36.2
N$10  (via drill 0.33)
  Top 0.254: IC12.6 24.07,2.26 C37.2 | IC11.8 19.31,12.2 v19.56,12.45
  Bottom 0.254: v19.56,12.45 19.56,4.06 20.83,2.79 22.8,2.79 IC12.6
OUT0
  Top 0.254: SV1.1 95.19,45.66 86.3,45.66 IC2.13 IC2.14
OUT1  (via drill 0.33)
  Top 0.254: v77.41,45.66 70.1,45.66 IC1.13 IC1.14
  Bottom 0.254: SV1.2 97.09,46.29 95.19,46.29 94.55,45.66 v77.41,45.66
OUT2
  Top 0.254: IC2.9 IC2.8 92.65,42.48 SV1.3
OUT3  (via drill 0.33)
  Top 0.254: v77.41,43.75 76.51,43.75 IC1.8 IC1.9
  Bottom 0.254: SV1.4 97.09,43.75 v77.41,43.75
OUT4  (via drill 0.33)
  Top 0.254: v77.41,38.67 76.51,38.67 IC1.7 IC1.6
  Bottom 0.254: SV1.5 94.55,38.67 v77.41,38.67
OUT5
  Top 0.254: SV1.6 97.09,41.21 93.92,41.21 92.65,39.94 IC2.7 IC2.6
OUT6  (via drill 0.33)
  Top 0.254: v77.41,36.77 70.1,36.77 IC1.2 IC1.1
  Bottom 0.254: SV1.7 94.87,37.4 94.23,36.77 v77.41,36.77
OUT7
  Top 0.254: SV1.8 97.09,38.67 95.19,38.67 93.28,36.77 86.3,36.77 IC2.2 IC2.1
OUT8
  Top 0.254: IC4.14 IC4.13 86.3,35.5 95.19,35.5 SV1.9
OUT9  (via drill 0.33)
  Top 0.254: v77.41,35.5 70.1,35.5 IC3.13 IC3.14
  Bottom 0.254: SV1.10 97.09,36.13 95.19,36.13 94.55,35.5 v77.41,35.5
OUT10
  Top 0.254: IC4.9 IC4.8 92.65,32.32 SV1.11
OUT11  (via drill 0.33)
  Top 0.254: v77.41,33.59 76.51,33.59 arc-90 IC3.8 IC3.9
  Bottom 0.254: SV1.12 97.09,33.59 v77.41,33.59
OUT12  (via drill 0.33)
  Top 0.254: IC3.6 IC3.7 76.51,28.51 v77.41,28.51
  Bottom 0.254: SV1.13 94.55,28.51 v77.41,28.51
OUT13
  Top 0.254: IC4.6 IC4.7 92.65,29.78 93.92,31.05 97.09,31.05 SV1.14
OUT14  (via drill 0.33)
  Top 0.254: IC3.1 IC3.2 70.1,26.61 v77.41,26.61
  Bottom 0.254: SV1.15 94.87,27.24 94.23,26.61 v77.41,26.61
OUT15
  Top 0.254: IC4.1 IC4.2 86.3,26.61 93.28,26.61 95.19,28.51 97.09,28.51 SV1.16
OUT16
  Top 0.254: IC6.14 IC6.13 86.3,25.34 95.19,25.34 SV1.17
OUT17  (via drill 0.33)
  Top 0.254: IC5.14 IC5.13 70.1,25.34 v77.41,25.34
  Bottom 0.254: SV1.18 97.09,25.97 95.19,25.97 94.55,25.34 v77.41,25.34
OUT18
  Top 0.254: IC6.9 IC6.8 92.65,22.16 SV1.19
OUT19  (via drill 0.33)
  Top 0.254: IC5.9 IC5.8 76.51,23.43 v77.41,23.43
  Bottom 0.254: SV1.20 97.09,23.43 v77.41,23.43
OUT20  (via drill 0.33)
  Top 0.254: IC5.6 IC5.7 76.51,18.35 v77.41,18.35
  Bottom 0.254: SV1.21 94.55,18.35 v77.41,18.35
OUT21
  Top 0.254: IC6.6 IC6.7 92.65,19.62 93.92,20.89 97.09,20.89 SV1.22
OUT22  (via drill 0.33)
  Top 0.254: IC5.1 IC5.2 70.1,16.45 v77.41,16.45
  Bottom 0.254: SV1.23 94.87,17.08 94.23,16.45 v77.41,16.45
OUT23
  Top 0.254: IC6.1 IC6.2 86.3,16.45 93.28,16.45 95.19,18.35 97.09,18.35 SV1.24
OUT24
  Top 0.254: IC8.14 IC8.13 86.3,15.18 95.19,15.18 SV1.25
OUT25  (via drill 0.33)
  Top 0.254: IC7.14 IC7.13 70.1,15.18 v77.41,15.18
  Bottom 0.254: SV1.26 97.09,15.81 95.19,15.81 94.55,15.18 v77.41,15.18
OUT26
  Top 0.254: IC8.9 IC8.8 92.65,12 SV1.27
OUT27  (via drill 0.33)
  Top 0.254: IC7.9 IC7.8 76.51,13.27 v77.41,13.27
  Bottom 0.254: SV1.28 97.09,13.27 v77.41,13.27
OUT28  (via drill 0.33)
  Top 0.254: IC7.6 IC7.7 76.51,8.19 v77.41,8.19
  Bottom 0.254: SV1.29 94.55,8.19 v77.41,8.19
OUT29
  Top 0.254: IC8.6 IC8.7 92.65,9.46 93.92,10.73 97.09,10.73 SV1.30
OUT30  (via drill 0.33)
  Top 0.254: IC7.1 IC7.2 70.1,6.29 v77.41,6.29
  Bottom 0.254: SV1.31 94.55,6.92 93.92,6.29 v77.41,6.29
OUT31
  Top 0.254: IC8.1 IC8.2 86.3,6.29 93.28,6.29 95.19,8.19 97.09,8.19 SV1.32
V+  (via drill 0.33)  (1 unrouted)
  Top 0.406: v61.53,40.58 60.9,39.94 60.9,30.42 | 60.9,30.42 v60.9,25.97 60.9,22.8 61.53,22.16 v61.53,20.26 60.9,19.62 v60.9,10.1 v60.9,5.65 62.17,4.38 SV1.33 | v61.53,30.42 60.9,30.42 | IC1.4 v72.64,40.26 | IC2.4 v88.84,40.26 | IC4.4 v88.84,30.1 | v72.64,30.1 IC3.4 | v72.64,19.94 IC5.4 | IC6.4 v88.84,19.94 | IC8.4 v88.84,9.78 | IC7.4 v72.64,9.78 | v45.66,29.15 IC9.27 | IC10.27 v45.66,8.83 | IO-AN.5 37.08,18.03 36.96,18.16 37.08,18.29 v37.08,19.56 37.08,26.92 32.09,31.92 C34.1 C33.1 23.84,31.37 U$1.2
  Bottom 0.406: 87.78,40.58 72.64,40.58 | v61.53,40.58 71.59,40.58 | v88.84,30.1 88.84,30.42 87.88,30.42 | 87.88,30.42 72.64,30.42 | 71.69,30.42 71.06,30.42 | 71.06,30.42 v61.53,30.42 | v88.84,19.94 88.84,20.26 87.57,20.26 | 87.57,20.26 72.64,20.26 | 71.69,20.26 v61.53,20.26 | v88.84,9.78 88.84,10.1 87.88,10.1 | 87.88,10.1 72.64,10.1 | 71.59,10.1 v60.9,10.1 | v60.9,25.97 48.04,25.97 48.04,28.99 | v72.64,40.26 72.64,40.58 | 72.64,40.58 71.59,40.58 | 71.59,40.58 C48.2 | v88.84,40.26 88.84,40.58 87.78,40.58 | 87.78,40.58 C52.2 | C53.2 87.67,30.2 87.88,30.42 | 71.06,30.42 71.27,30.2 C49.2 71.48,30.2 71.69,30.42 | 71.69,30.42 72.64,30.42 | 72.64,30.42 v72.64,30.1 | C50.2 71.48,20.04 71.69,20.26 | 71.69,20.26 72.64,20.26 | 72.64,20.26 v72.64,19.94 | C54.2 87.57,20.26 | C55.2 87.67,9.88 87.88,10.1 | v72.64,9.78 72.64,10.1 | 72.64,10.1 71.59,10.1 | 71.59,10.1 C51.2 | 48.04,28.99 48.04,29.15 C57.2 | C57.2 v45.66,29.15 | v45.66,8.83 46.29,8.83 | 46.29,5.65 v60.9,5.65 | J1.1 46.29,5.65 | 46.29,5.65 46.29,8.83 | C39.2 C40.2 | C39.2 IC12.8 | C44.2 C43.2 IC13.8 28.99,19.59 29.21,19.81 36.83,19.81 v37.08,19.56 | 46.29,8.83 C56.2 | C57.2 47.98,29.04 48.04,28.99 | IO-AN.5 35.81,5.59 31.5,5.59 29.97,7.11 29.23,7.11 C39.2
V-  (via drill 0.33)  (1 unrouted)
  Top 0.406: v60.9,41.85 59.63,40.58 v59.63,31.69 59.63,27.88 | 59.63,27.88 59.63,21.53 | 59.63,21.53 v59.63,11.37 59.63,7.56 | 59.63,21.53 v60.58,21.53 | 59.63,7.56 59.63,4.06 61.85,1.84 SV1.35 | IC3.11 v72.64,32 | IC1.11 v72.64,42.16 | IC2.11 v88.84,42.16 | v88.84,32 IC4.11 | IC5.11 v72.64,21.84 | v88.84,21.84 IC6.11 | IC8.11 v88.84,11.68 | v72.64,11.68 IC7.11 | 59.63,27.88 IC9.1 51.37,27.88 v51.37,29.15 | 59.63,7.56 IC10.1 51.37,7.56 | J1.3 51.37,7.56 | 51.37,7.56 v51.37,8.83
  Bottom 0.406: 71.59,41.85 v60.9,41.85 | 72.64,41.85 87.78,41.85 | 71.59,31.69 v59.63,31.69 | v88.84,21.84 88.84,21.53 87.57,21.53 | 87.57,21.53 72.64,21.53 | 72.64,21.53 71.37,21.53 | 71.37,21.53 v60.58,21.53 | v88.84,11.68 88.84,11.37 87.57,11.37 | 87.57,11.37 72.64,11.37 | 71.37,11.37 v59.63,11.37 | v72.64,32 72.64,31.69 | 72.64,31.69 71.59,31.69 | 71.59,31.69 C49.1 | v72.64,42.16 72.64,41.85 | 72.64,41.85 71.59,41.85 | 71.59,41.85 C48.1 | v88.84,42.16 88.84,41.85 87.78,41.85 | 87.78,41.85 C52.1 | 72.64,31.69 87.88,31.69 | 87.88,31.69 88.84,31.69 v88.84,32 | C53.1 87.67,31.9 87.88,31.69 | v72.64,21.84 72.64,21.53 | C50.1 71.37,21.53 | C54.1 87.57,21.53 | C55.1 87.57,11.37 | C51.1 71.37,11.37 | 71.37,11.37 72.64,11.37 | 72.64,11.37 v72.64,11.68 | IC12.4 C42.1 C41.1 25.25,9.91 38.61,9.91 | IC13.4 C46.1 C45.1 25.19,25.4 37.08,25.4 38.61,23.88 38.61,9.91 | v51.37,8.83 C56.1 | v51.37,29.15 C57.1 | IO-AN.4 35.81,3.05 37.85,3.05 38.61,3.81 38.61,9.91
V-REF
  Top 0.254: 17.63,16.69 IC11.17 | 14.8,15.7 14.8,10.7 | 14.8,10.7 14.8,9.7 IC11.3 | IC11.15 14.8,15.7 | IC11.5 14.8,10.7 | IC11.17 14.8,16.7 14.8,15.7 | IC11.17 18.8,16.7 18.8,32.51 16.83,32.51 U$1.6
VOUT1  (2 unrouted)
  Top 0.254: 26.61,2.26 IC12.7 20.47,10.2 IC11.4 | 26.61,2.26 C37.1 | 26.61,2.26 33.49,2.26 34.86,0.89 36.77,0.89 IO-AN.1
VOUT2  (via drill 0.33)  (1 unrouted)
  Top 0.254: IC13.7 26.45,17.66 C36.1 26.19,17.4 29.46,17.4 32.96,13.91 32.96,4.86 35.5,2.32 IO-AN.2 | IC11.16 19.5,16.2 v19.56,16.26
  Bottom 0.254: v19.56,16.26 26.16,16.26 26.42,16.51 26.42,19.43 IC13.7
VOUT-JMP  (1 unrouted)